# Altium schematic sheet headers.SchDoc
size A4
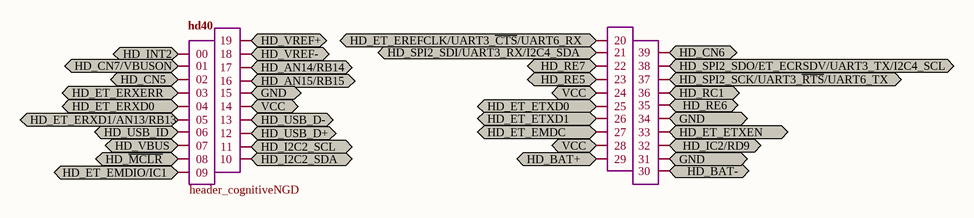
[diagram p0: headers.SchDoc]

## Parts
hd40  header_cognitiveNGD  [header_cognitiveNGD]

## Ports
GND, HD_AN14/RB14, HD_AN15/RB15, HD_BAT+, HD_BAT-, HD_CN5, HD_CN6, HD_CN7/VBUSON, HD_ET_EMDC, HD_ET_EMDIO/IC1, HD_ET_EREFCLK/UART3_~{CTS}/UART6_RX, HD_ET_ERXD0, HD_ET_ERXD1/AN13/RB13, HD_ET_ERXERR, HD_ET_ETXD0, HD_ET_ETXD1, HD_ET_ETXEN, HD_I2C2_SCL, HD_I2C2_SDA, HD_IC2/RD9, HD_INT2, HD_RC1, HD_RE5, HD_RE6, HD_RE7, HD_SPI2_SCK/UART3_~{RTS}/UART6_TX, HD_SPI2_SDI/UART3_RX/I2C4_SDA, HD_SPI2_SDO/ET_ECRSDV/UART3_TX/I2C4_SCL, HD_USB_D+, HD_USB_D-, HD_USB_ID, HD_VBUS, HD_VREF+, HD_VREF-, HD_~{MCLR}, VCC

## Nets
GND: hd40.15 hd40.31 hd40.34 ; port GND
HD_AN14/RB14: hd40.17 ; port HD_AN14/RB14
HD_AN15/RB15: hd40.16 ; port HD_AN15/RB15
HD_BAT+: hd40.29 ; port HD_BAT+
HD_BAT-: hd40.30 ; port HD_BAT-
HD_CN5: hd40.02 ; port HD_CN5
HD_CN6: hd40.39 ; port HD_CN6
HD_CN7/VBUSON: hd40.01 ; port HD_CN7/VBUSON
HD_ET_EMDC: hd40.27 ; port HD_ET_EMDC
HD_ET_EMDIO/IC1: hd40.09 ; port HD_ET_EMDIO/IC1
HD_ET_EREFCLK/UART3_~{CTS}/UART6_RX: hd40.20 ; port HD_ET_EREFCLK/UART3_~{CTS}/UART6_RX
HD_ET_ERXD0: hd40.04 ; port HD_ET_ERXD0
HD_ET_ERXD1/AN13/RB13: hd40.05 ; port HD_ET_ERXD1/AN13/RB13
HD_ET_ERXERR: hd40.03 ; port HD_ET_ERXERR
HD_ET_ETXD0: hd40.25 ; port HD_ET_ETXD0
HD_ET_ETXD1: hd40.26 ; port HD_ET_ETXD1
HD_ET_ETXEN: hd40.33 ; port HD_ET_ETXEN
HD_I2C2_SCL: hd40.11 ; port HD_I2C2_SCL
HD_I2C2_SDA: hd40.10 ; port HD_I2C2_SDA
HD_IC2/RD9: hd40.32 ; port HD_IC2/RD9
HD_INT2: hd40.00 ; port HD_INT2
HD_~{MCLR}: hd40.08 ; port HD_~{MCLR}
HD_RC1: hd40.36 ; port HD_RC1
HD_RE5: hd40.23 ; port HD_RE5
HD_RE6: hd40.35 ; port HD_RE6
HD_RE7: hd40.22 ; port HD_RE7
HD_SPI2_SCK/UART3_~{RTS}/UART6_TX: hd40.37 ; port HD_SPI2_SCK/UART3_~{RTS}/UART6_TX
HD_SPI2_SDI/UART3_RX/I2C4_SDA: hd40.21 ; port HD_SPI2_SDI/UART3_RX/I2C4_SDA
HD_SPI2_SDO/ET_ECRSDV/UART3_TX/I2C4_SCL: hd40.38 ; port HD_SPI2_SDO/ET_ECRSDV/UART3_TX/I2C4_SCL
HD_USB_D+: hd40.12 ; port HD_USB_D+
HD_USB_D-: hd40.13 ; port HD_USB_D-
HD_USB_ID: hd40.06 ; port HD_USB_ID
HD_VBUS: hd40.07 ; port HD_VBUS
HD_VREF+: hd40.19 ; port HD_VREF+
HD_VREF-: hd40.18 ; port HD_VREF-
VCC: hd40.14 hd40.24 hd40.28 ; port VCC